# Altium schematic sheet 2_MCU.SchDoc
size A3; DocumentNumber: 2; SheetNumber: 2; SheetTotal: 6
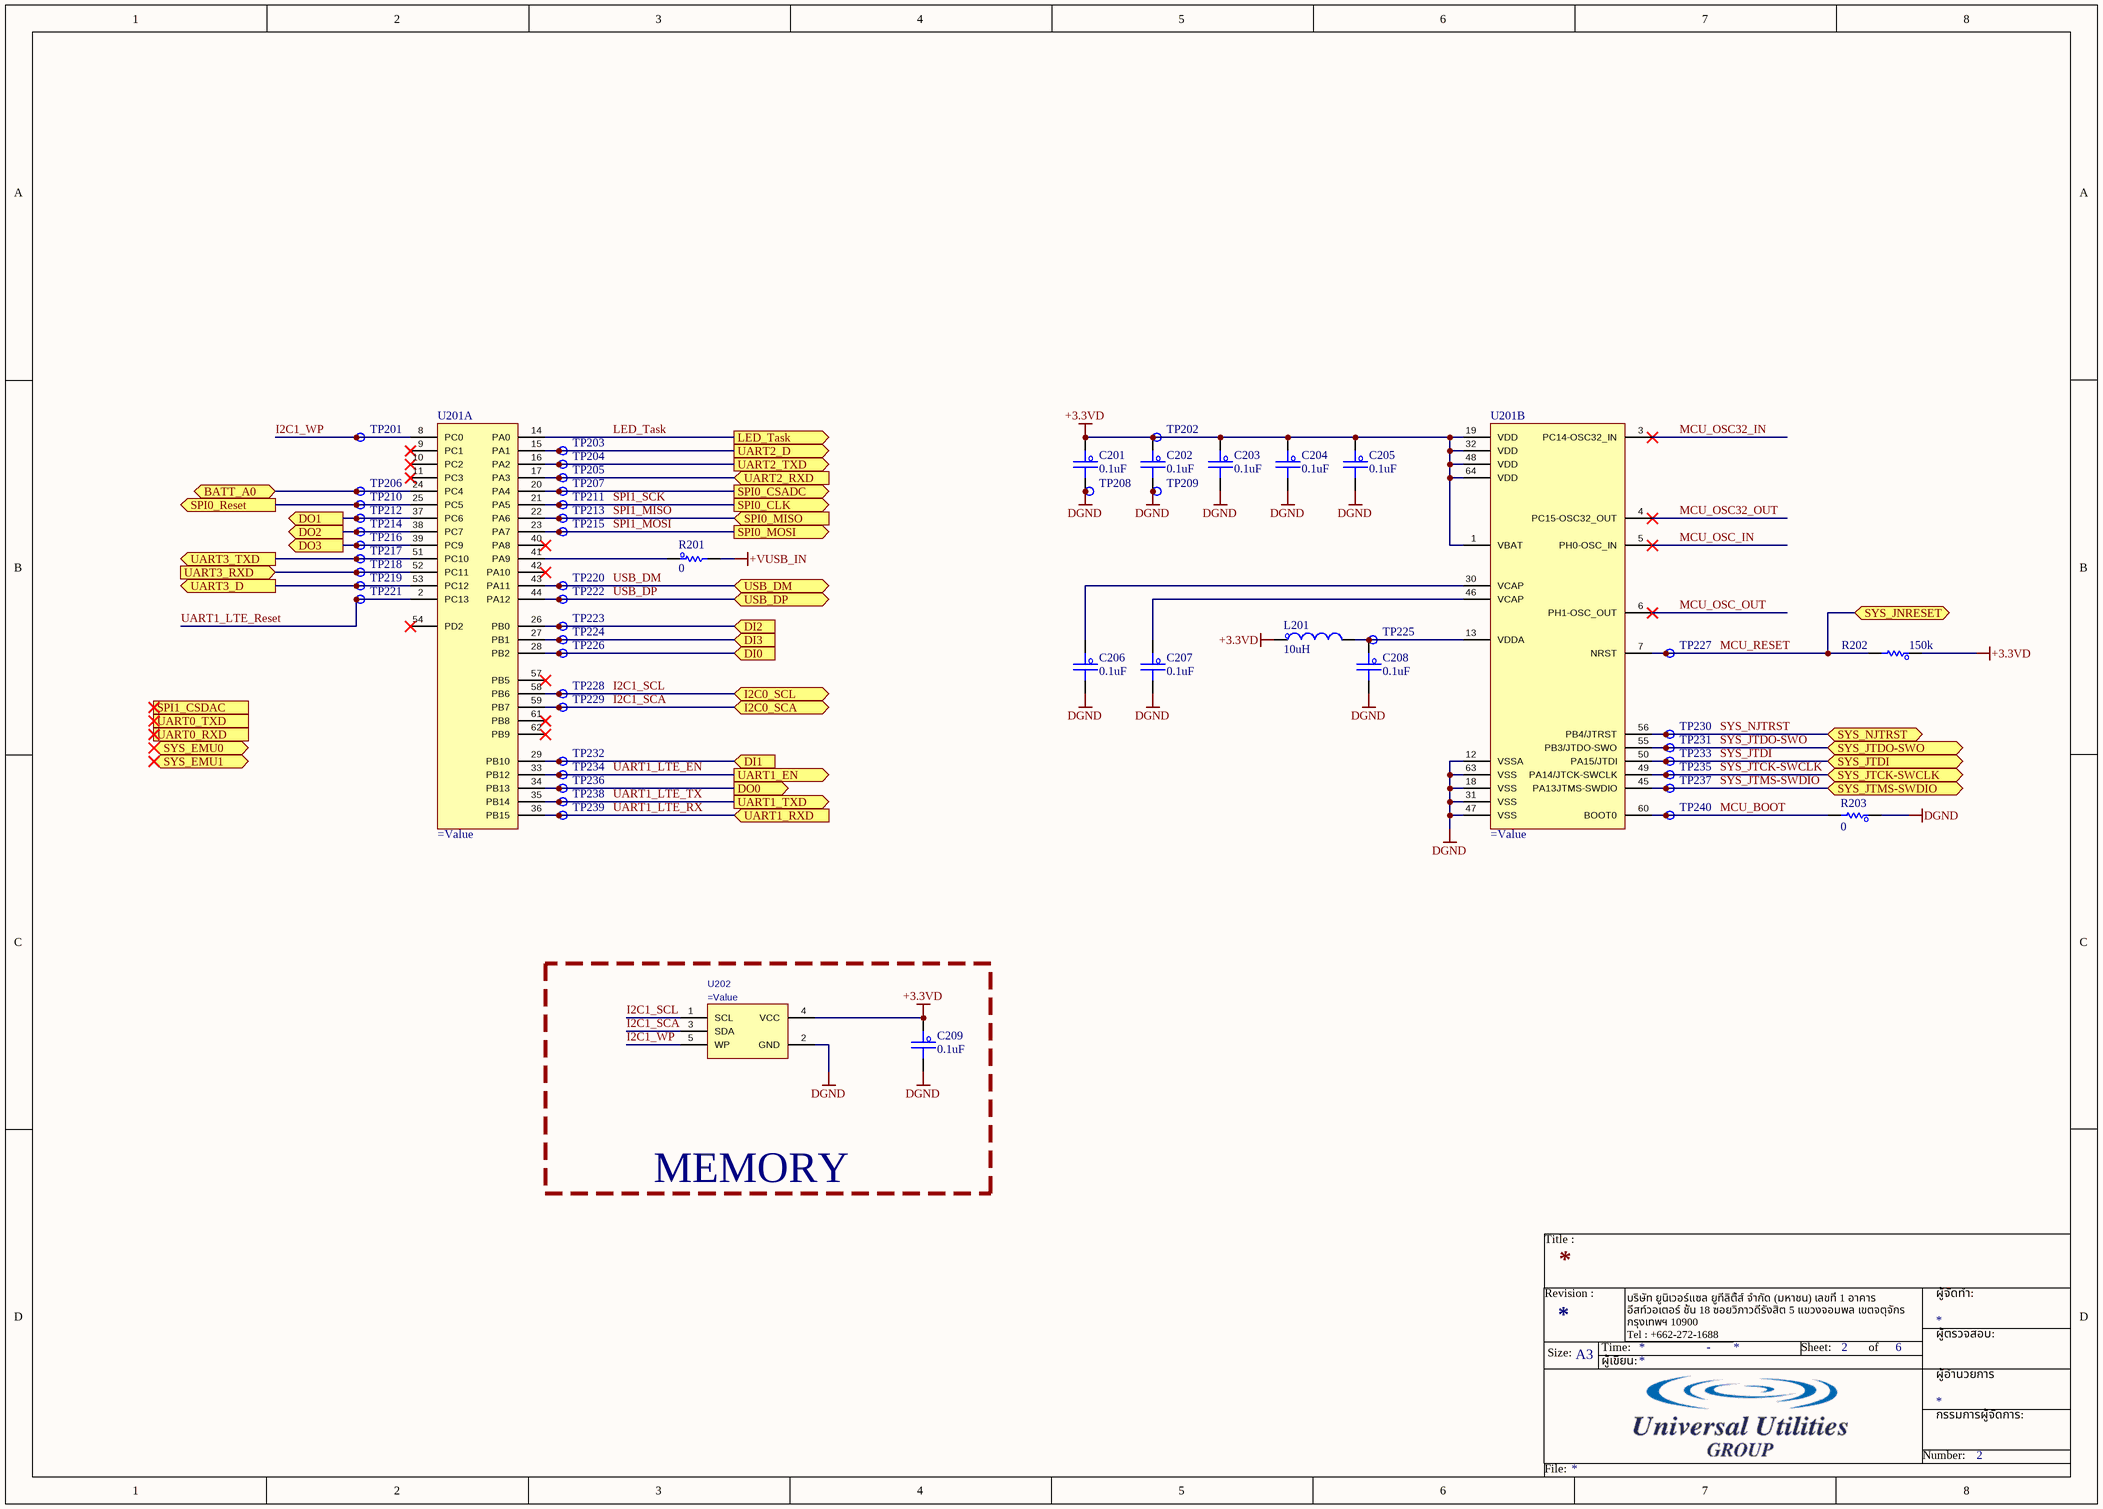
[diagram p0: 2_MCU.SchDoc]

## Parts
C201  0.1uF  [C_0603]
C202  0.1uF  [C_0603]
C203  0.1uF  [C_0603]
C204  0.1uF  [C_0603]
C205  0.1uF  [C_0603]
C206  0.1uF  [C_0603]
C207  0.1uF  [C_0603]
C208  0.1uF  [C_0603]
C209  0.1uF  [C_0603]
L201  10uH  [L_0603]
R201  0  [R_0603]
R202  150k  [R_0603]
R203  0  [R_0603]
TP201  (no value)  [TP_Testpoint]  (no BOM)
TP202  (no value)  [TP_Testpoint]  (no BOM)
TP203  (no value)  [TP_Testpoint]  (no BOM)
TP204  (no value)  [TP_Testpoint]  (no BOM)
TP205  (no value)  [TP_Testpoint]  (no BOM)
TP206  (no value)  [TP_Testpoint]  (no BOM)
TP207  (no value)  [TP_Testpoint]  (no BOM)
TP208  (no value)  [TP_Testpoint]  (no BOM)
TP209  (no value)  [TP_Testpoint]  (no BOM)
TP210  (no value)  [TP_Testpoint]  (no BOM)
TP211  (no value)  [TP_Testpoint]  (no BOM)
TP212  (no value)  [TP_Testpoint]  (no BOM)
TP213  (no value)  [TP_Testpoint]  (no BOM)
TP214  (no value)  [TP_Testpoint]  (no BOM)
TP215  (no value)  [TP_Testpoint]  (no BOM)
TP216  (no value)  [TP_Testpoint]  (no BOM)
TP217  (no value)  [TP_Testpoint]  (no BOM)
TP218  (no value)  [TP_Testpoint]  (no BOM)
TP219  (no value)  [TP_Testpoint]  (no BOM)
TP220  (no value)  [TP_Testpoint]  (no BOM)
TP221  (no value)  [TP_Testpoint]  (no BOM)
TP222  (no value)  [TP_Testpoint]  (no BOM)
TP223  (no value)  [TP_Testpoint]  (no BOM)
TP224  (no value)  [TP_Testpoint]  (no BOM)
TP225  (no value)  [TP_Testpoint]  (no BOM)
TP226  (no value)  [TP_Testpoint]  (no BOM)
TP227  (no value)  [TP_Testpoint]  (no BOM)
TP228  (no value)  [TP_Testpoint]  (no BOM)
TP229  (no value)  [TP_Testpoint]  (no BOM)
TP230  (no value)  [TP_Testpoint]  (no BOM)
TP231  (no value)  [TP_Testpoint]  (no BOM)
TP232  (no value)  [TP_Testpoint]  (no BOM)
TP233  (no value)  [TP_Testpoint]  (no BOM)
TP234  (no value)  [TP_Testpoint]  (no BOM)
TP235  (no value)  [TP_Testpoint]  (no BOM)
TP236  (no value)  [TP_Testpoint]  (no BOM)
TP237  (no value)  [TP_Testpoint]  (no BOM)
TP238  (no value)  [TP_Testpoint]  (no BOM)
TP239  (no value)  [TP_Testpoint]  (no BOM)
TP240  (no value)  [TP_Testpoint]  (no BOM)
U201  (no value)  [LQFP64]  (parts A,B of 2)
U202  (no value)  [SOT65P210X110-5N]

## Blocks framed on the sheet
MEMORY: C209 U202

## Ports
BATT_A0 (bidir), DI0 (in), DI1 (in), DI2 (in), DI3 (in), DO0 (out), DO1 (out), DO2 (out), DO3 (out), I2C0_SCA (bidir), I2C0_SCL (bidir), LED_Task (out), SPI0_CLK (out), SPI0_CSADC (out), SPI0_MISO (in), SPI0_MOSI (out), SPI0_Reset (out), SPI1_CSDAC (out), SYS_EMU0 (bidir), SYS_EMU1 (bidir), SYS_JNRESET (bidir), SYS_JTCK-SWCLK (bidir), SYS_JTDI (bidir), SYS_JTDO-SWO (bidir), SYS_JTMS-SWDIO (bidir), SYS_NJTRST (bidir), UART0_RXD (in), UART0_TXD (out), UART1_EN (out), UART1_RXD (in), UART1_TXD (out), UART2_D (out), UART2_RXD (in), UART2_TXD (out), UART3_D (out), UART3_RXD (in), UART3_TXD (out), USB_DM (bidir), USB_DP (bidir)

## Nets
+3.3VD: C201.1 C202.1 C203.1 C204.1 C205.1 C209.1 L201.1 R202.1 TP202.1 U201.1(VBAT) U201.19(VDD) U201.32(VDD) U201.48(VDD) U201.64(VDD) U202.4(VCC)
+VUSB_IN: R201.2
DGND: C201.2 C202.2 C203.2 C204.2 C205.2 C206.2 C207.2 C208.2 C209.2 R203.1 TP208.1 TP209.1 U201.12(VSSA) U201.18(VSS) U201.31(VSS) U201.47(VSS) U201.63(VSS) U202.2(GND)
BATT_A0: TP206.1 U201.24(PC4) ; port BATT_A0
DI0: TP226.1 U201.28(PB2) ; port DI0
DI1: TP232.1 U201.29(PB10) ; port DI1
DI2: TP223.1 U201.26(PB0) ; port DI2
DI3: TP224.1 U201.27(PB1) ; port DI3
DO0: TP236.1 U201.34(PB13) ; port DO0
DO1: TP212.1 U201.37(PC6) ; port DO1
DO2: TP214.1 U201.38(PC7) ; port DO2
DO3: TP216.1 U201.39(PC9) ; port DO3
I2C1_SCA: TP229.1 U201.59(PB7) U202.3(SDA) ; port I2C0_SCA
I2C1_SCL: TP228.1 U201.58(PB6) U202.1(SCL) ; port I2C0_SCL
I2C1_WP: TP201.1 U201.8(PC0) U202.5(WP)
LED_Task: U201.14(PA0) ; port LED_Task
MCU_BOOT: R203.2 TP240.1 U201.60(BOOT0)
MCU_OSC32_IN: U201.3(PC14-OSC32_IN)
MCU_OSC32_OUT: U201.4(PC15-OSC32_OUT)
MCU_OSC_IN: U201.5(PH0-OSC_IN)
MCU_OSC_OUT: U201.6(PH1-OSC_OUT)
MCU_RESET: R202.2 TP227.1 U201.7(NRST) ; port SYS_JNRESET
SPI0_CSADC: TP207.1 U201.20(PA4) ; port SPI0_CSADC
SPI0_Reset: TP210.1 U201.25(PC5) ; port SPI0_Reset
SPI1_MISO: TP213.1 U201.22(PA6) ; port SPI0_MISO
SPI1_MOSI: TP215.1 U201.23(PA7) ; port SPI0_MOSI
SPI1_SCK: TP211.1 U201.21(PA5) ; port SPI0_CLK
SYS_JTCK-SWCLK: TP235.1 U201.49(PA14/JTCK-SWCLK) ; port SYS_JTCK-SWCLK
SYS_JTDI: TP233.1 U201.50(PA15/JTDI) ; port SYS_JTDI
SYS_JTDO-SWO: TP231.1 U201.55(PB3/JTDO-SWO) ; port SYS_JTDO-SWO
SYS_JTMS-SWDIO: TP237.1 U201.45(PA13JTMS-SWDIO) ; port SYS_JTMS-SWDIO
SYS_NJTRST: TP230.1 U201.56(PB4/JTRST) ; port SYS_NJTRST
UART1_LTE_EN: TP234.1 U201.33(PB12) ; port UART1_EN
UART1_LTE_Reset: TP221.1 U201.2(PC13)
UART1_LTE_RX: TP239.1 U201.36(PB15) ; port UART1_RXD
UART1_LTE_TX: TP238.1 U201.35(PB14) ; port UART1_TXD
UART2_D: TP203.1 U201.15(PA1) ; port UART2_D
UART2_RXD: TP205.1 U201.17(PA3) ; port UART2_RXD
UART2_TXD: TP204.1 U201.16(PA2) ; port UART2_TXD
UART3_D: TP219.1 U201.53(PC12) ; port UART3_D
UART3_RXD: TP218.1 U201.52(PC11) ; port UART3_RXD
UART3_TXD: TP217.1 U201.51(PC10) ; port UART3_TXD
USB_DM: TP220.1 U201.43(PA11) ; port USB_DM
USB_DP: TP222.1 U201.44(PA12) ; port USB_DP
NetC206_1: C206.1 U201.30(VCAP)
NetC207_1: C207.1 U201.46(VCAP)
NetC208_1: C208.1 L201.2 TP225.1 U201.13(VDDA)
NetR201_1: R201.1 U201.41(PA9)

Not connected (* = marked no-connect by the designer): U201 9(PC1)* 10(PC2)* 11(PC3)* 40(PA8)* 42(PA10)* 54(PD2)* 57(PB5)* 61(PB8)* 62(PB9)*

## Notes on the sheet
- Title :
- Revision :
- ผู้จัดทำ:
- Size:
- A3
- Time:
- ผู้เขียน:
- บริษัท ยูนิเวอร์แซล ยูทีลิตี้ส์ จำกัด (มหาชน) เลขที่ 1 อาคาร อีสท์วอเตอร์ ชั้น 18 ซอยวิภาวดีรังสิต 5 แขวงจอมพล เขตจตุจักร กรุงเทพฯ 10900
  Tel : +662-272-1688
  Fax :+662-2721690-1
- -
- Sheet:
- of
- ผู้อำนวยการ
- ผู้ตรวจสอบ:
- Number:
- กรรมการผู้จัดการ:
- File:

## Library data of the parts
C201-C209 = C_Capacitor: CAP CER 0.1UF 50V X7R 0603; Manufacturer: KEMET; PartNumber: C0603C104K5RACTU; PackageReference: 0603; PartID: 399-5089-1-ND; Value2: 50V; Value: 0.1uF; Value3: *
L201 = L_Inductor: 10µH Shielded Multilayer Inductor 250mA 1.05Ohm 0603 (1608 Metric); Manufacturer: TDK Corporation; PartNumber: MLZ1608M100WT000; Value: 10uH; PackageReference: 0603; PartID: 445-6389-1-ND; Value3: *
R201 R203 = R_Resister: RES SMD 0 OHM JUMP 1/10W 0603; Manufacturer: Vishay Dale; PartNumber: CRCW06030000Z0EBC; Value2: 0.1W; Value: 0; PackageReference: 0603; PartID: 541-4013-1-ND; Value3: *
R202 = R_Resister: RES SMD 150K OHM 1% 1/10W 0603; Manufacturer: Vishay Dale; PartNumber: CRCW0603150KFKEAC; Value2: 0.1W; Value: 150k; PackageReference: 0603; PartID: 541-4034-1-ND; Value3: *
TP201-TP240 = TP_TestPoint: TestPoint; Manufacturer: *; PackageReference: *; PartID: *; PartNumber: *; Value2: *; Value3: *
U201 = IC_MCU_STM32H7A3RGT6: IC MCU 32BIT 1376KB FLSH 64LQFP; Manufacturer: STMicroelectronics; PartNumber: STM32H7A3RGT6; PartID: 511-STM32H7A3RGT6; PackageReference: LQFP-64; Value: STM32H7A3RGT6; Value2: *; Value3: *
U202 = IC_MEM_24AA02HT: IC EEPROM 2KBIT I2C SC70-5; Manufacturer: Microchip Technology; Value: 24AA02HT-I/LT; PackageReference: SC-70-5; PartID: 24AA02HT-I/LTCT-ND; PartNumber: 24AA02HT-I/LT